# Altium schematic sheet Heater Driver.SchDoc: MicroBAR - Step-Up DC-DC Converter for ITO Heater
size A; DrawnBy: Frankie Myers; Engineer: Frankie Myers; Organization: UC Berkeley
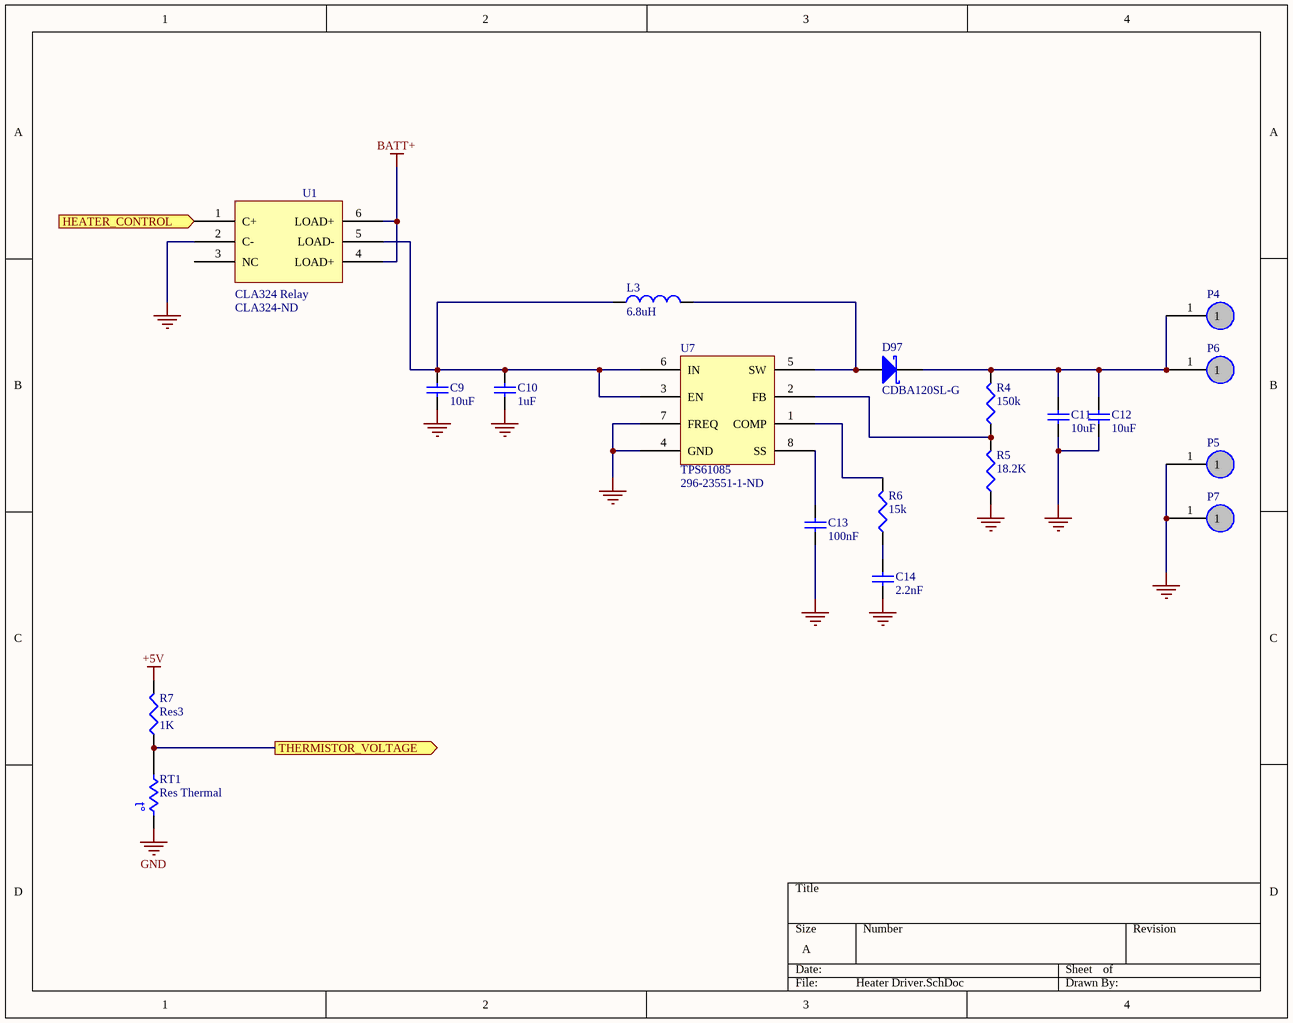
[diagram p0: Heater Driver.SchDoc]

## Parts
C9  value 10uF  [CAPC3216L]  (hidden comment: Cap Semi)
C10  value 1uF  [CAPC3216L]  (hidden comment: Cap Semi)
C11  value 10uF  [CAPC3216L]  (hidden comment: Cap Semi)
C12  value 10uF  [CAPC3216L]  (hidden comment: Cap Semi)
C13  value 100nF  [CAPC3216L]  (hidden comment: Cap Semi)
C14  value 2.2nF  [CAPC3216L]  (hidden comment: Cap Semi)
D97  CDBA120SL-G  [DSO-C2/G1.6]
L3  value 6.8uH  [MURATA SMT INDUCTOR]  (hidden comment: Inductor)
P4  LARGE_PIN  [2.5mm PIN]  (value not drawn)
P5  LARGE_PIN  [2.5mm PIN]  (value not drawn)
P6  LARGE_PIN  [2.5mm PIN]  (value not drawn)
P7  LARGE_PIN  [2.5mm PIN]  (value not drawn)
R4  value 150k  [RESC3216L]  (hidden comment: Res3)
R5  value 18.2K  [RESC3216L]  (hidden comment: Res3)
R6  value 15k  [RESC3216L]  (hidden comment: Res3)
R7  Res3  value 1K  [RESC3216M]
RT1  Res Thermal  [2MM JST PH - 2 PIN]
U1  CLA324 Relay  Supplier Part Number 1: CLA324-ND  [6-SMD]
U7  TPS61085  Supplier Part Number 1: 296-23551-1-ND  [DB008]

## Ports
HEATER_CONTROL, THERMISTOR_VOLTAGE

## Nets
+5V: R7.2
BATT+: U1.4(LOAD+) U1.6(LOAD+)
GND: C9.1 C10.1 C11.1 C12.1 C13.1 C14.1 P5.1 P7.1 R5.1 U1.2(C-) U7.4(GND) U7.7(FREQ)
HEATER_CONTROL: U1.1(C+) ; port HEATER_CONTROL
THERMISTOR_VOLTAGE: R7.1 RT1.2 ; port THERMISTOR_VOLTAGE
NetC9_2: C9.2 C10.2 L3.1 U1.5(LOAD-) U7.3(EN) U7.6(IN)
NetC11_2: C11.2 C12.2 D97.2(K) P4.1 P6.1 R4.2
NetC13_2: C13.2 U7.8(SS)
NetC14_2: C14.2 R6.1
NetD97_1: D97.1(A) L3.2 U7.5(SW)
NetR4_1: R4.1 R5.2 U7.2(FB)
NetR6_2: R6.2 U7.1(COMP)

Not connected (* = marked no-connect by the designer): RT1 1; U1 3(NC)

## Notes on the sheet
- Labels drawn without touching a wire or pin: GND
- (in symbol Res Thermal) t°

## Library data of the parts
C9-C14 = Cap Semi: Capacitor (Semiconductor SIM Model); Published: 8-Jun-2000; LatestRevisionDate: 29-May-2009; LatestRevisionNote: IPC-7351 Footprint Added.; PackageReference: C1206; Publisher: Altium Limited; PackageDescription: Chip Capacitor
D97 = Diode BAS70: Note: Pin 2 is not connected and not drawn.; Published: 21-Mar-2003; LatestRevisionDate: 29-May-2009; LatestRevisionNote: IPC-7351 Footprint Added.; DatasheetVersion: Oct-1999; PackageVersion: Sep-2001; PackageReference: SOT-23; Publisher: Altium Limited; PackageDescription: 3-Pin SOT-23 Package 0.95 mm Pitch, 2.5 mm Lead Span; ComponentLink1Description: Manufacturer Link; ComponentLink1URL: http://www.infineon.com/; ComponentLink2Description: Datasheet; ComponentLink2URL: http://www.infineon.com/upload/Document/cmc_upload/documents/009/382/bas40_bas140series_1.pdf
L3 = Inductor: Code_IEC: 1005; Published: 8-Jun-2000; LatestRevisionDate: 29-May-2009; LatestRevisionNote: IPC-7351 Footprint Added.; PackageReference: 0402-A; Publisher: Altium Limited; PackageDescription: Chip Inductor; Code_JEITA: 0402
R4-R7 = Res3: Resistor; Published: 8-Jun-2000; PackageReference: J1-0603; Publisher: Altium Limited
  R4-R6: LatestRevisionDate: 29-May-2009; LatestRevisionNote: IPC-7351 Footprint Added.; PackageDescription: Chip Resistor
  R7: LatestRevisionDate: 04-Mar-2005; LatestRevisionNote: PCB Footprint replaced.
RT1 = Res Thermal: Thermistor; Published: 24-Mar-1999; LatestRevisionDate: 04-Mar-2005; LatestRevisionNote: PCB Footprint replaced.; PackageReference: 6-0805; Publisher: Altium Limited
U1 = CLA324 Relay: Supplier 1: Digi-Key
U7 = TPS61085: Supplier 1: Digi-Key